# Altium schematic sheet quadrotor_100N_Sheet1.SchDoc
size A2
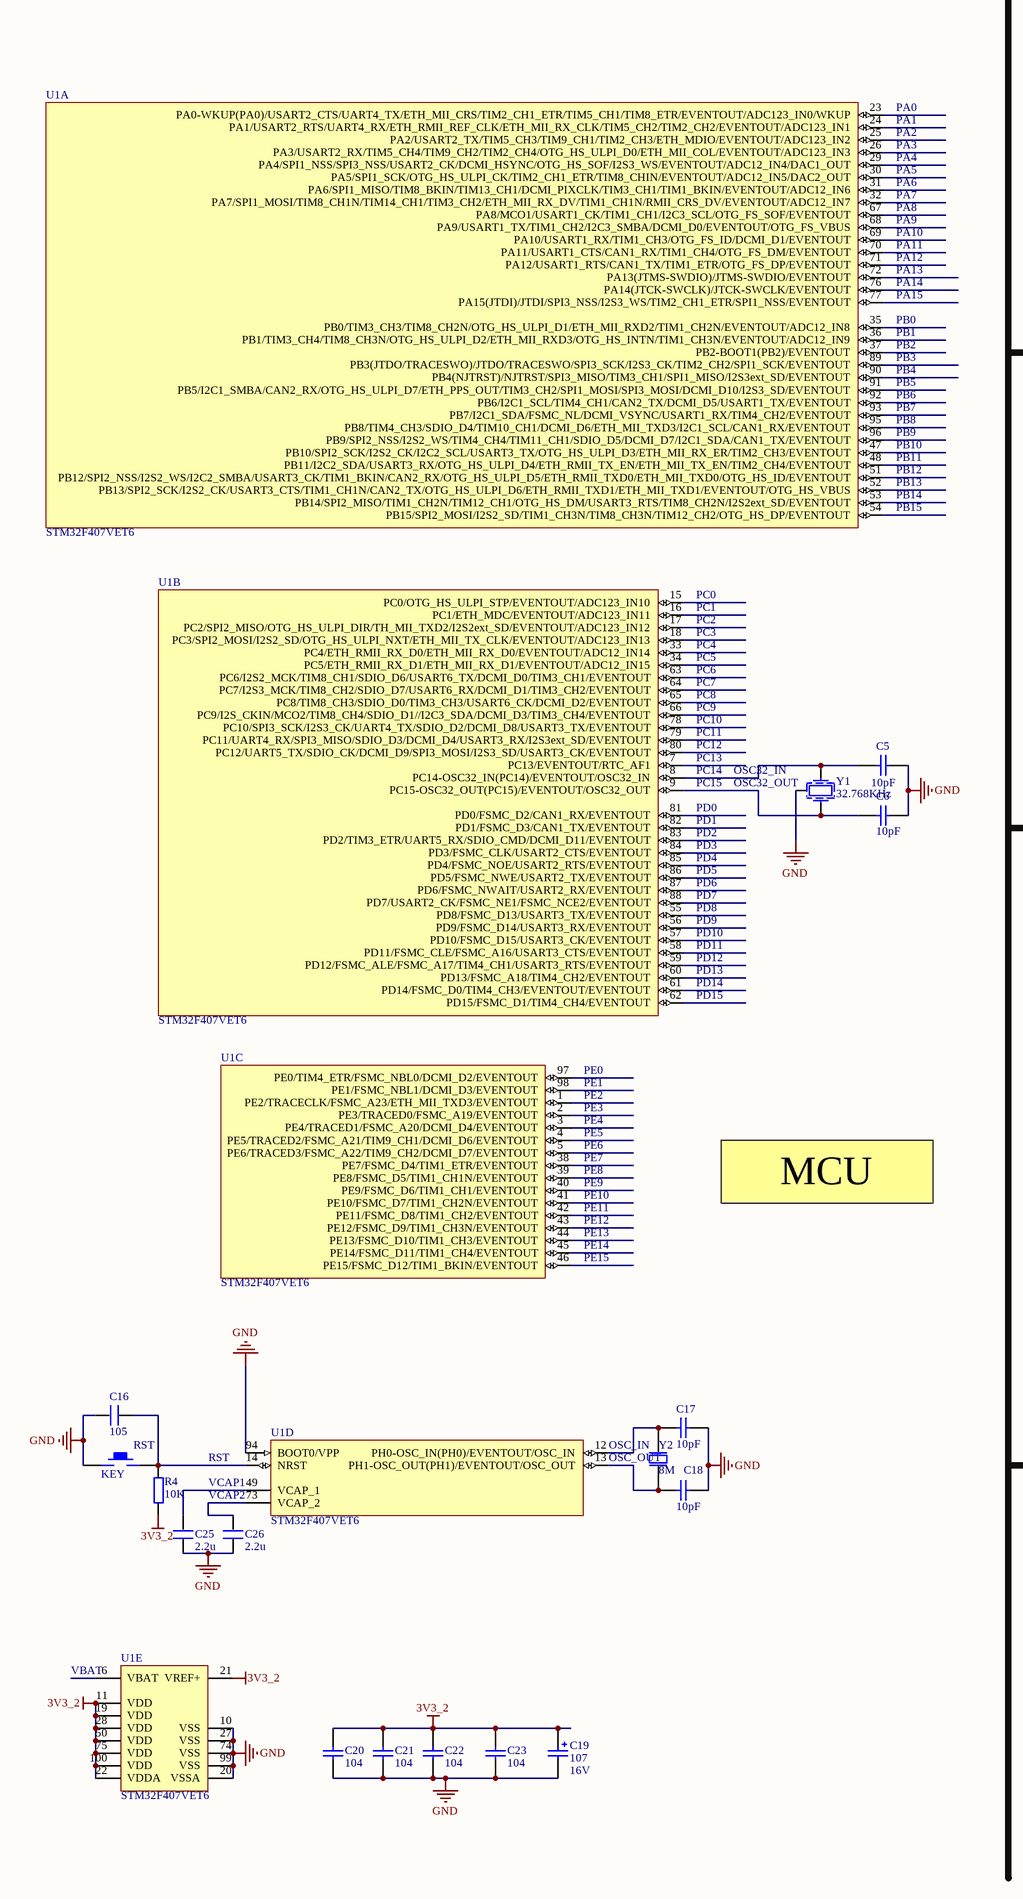
[diagram p0: quadrotor_100N_Sheet1.SchDoc, left]
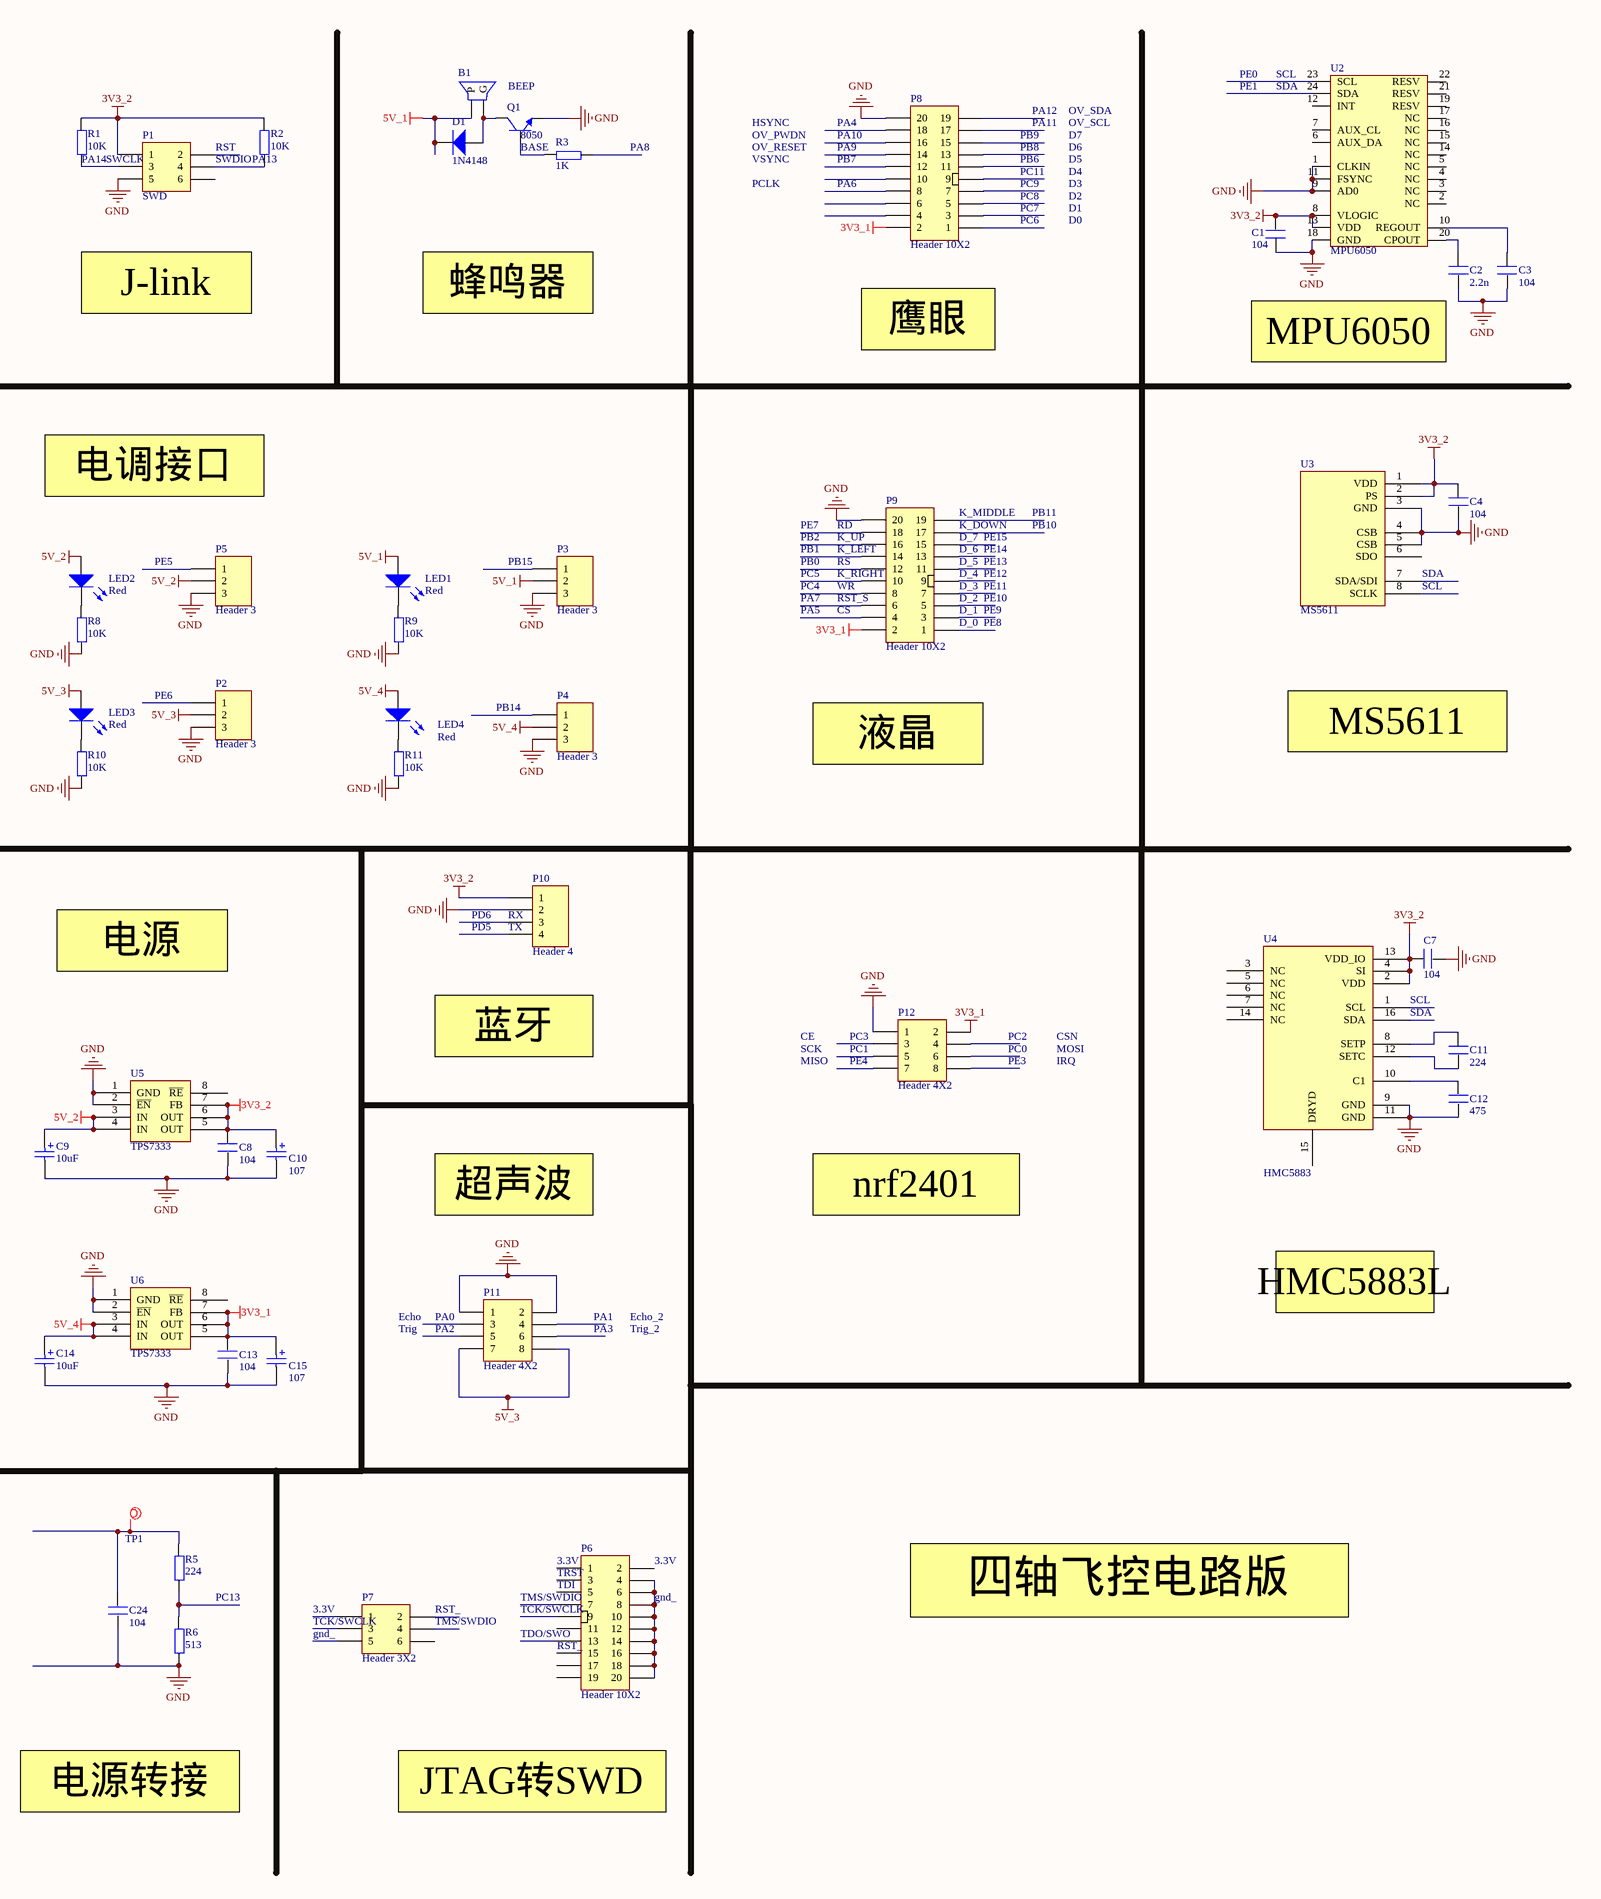
[diagram p1: quadrotor_100N_Sheet1.SchDoc, right]

## Parts
B1  BEEP  [BEEP]
C1  104  [C0805]
C2  2.2n  [C0805]
C3  104  [C0805]
C4  104  [C0805]
C5  10pF  [CAPC2012[0805]]
C6  10pF  [CAPC2012[0805]]
C7  104  [C0805]
C8  104  [C0805]
C9  10uF  [CAPS8]
C10  107  [CAPT6032]
C11  224  [C0805]
C12  475  [C0805]
C13  104  [C0805]
C14  10uF  [CAPS8]
C15  107  [CAPT6032]
C16  105  [C0805]
C17  10pF  [CAPC2012[0805]]
C18  10pF  [CAPC2012[0805]]
C19  Voltage: 16V  [CAPT6032]  (hidden comment: 107)
C20  104  [CAPC2012[0805]]
C21  104  [CAPC2012[0805]]
C22  104  [CAPC2012[0805]]
C23  104  [CAPC2012[0805]]
C24  104  [0805C]
C25  2.2u  [C0805]
C26  2.2u  [C0805]
D1  1N4148  [SOD-80[LL-34]]
LED1  Red  [LEDC2012(0805)]
LED2  Red  [LEDC2012(0805)]
LED3  Red  [LEDC2012(0805)]
LED4  Red  [LEDC2012(0805)]
P1  SWD  [HDR2X3]
P2  Header 3  [HDR1X3]
P3  Header 3  [HDR1X3]
P4  Header 3  [HDR1X3]
P5  Header 3  [HDR1X3]
P6  Header 10X2  [IDC2.54-20]
P7  Header 3X2  [HDR2X3]
P8  Header 10X2  [HDR2X10]
P9  Header 10X2  [HDR2X10]
P10  Header 4  [HX2.54V-4]
P11  Header 4X2  [HDR2X4]
P12  Header 4X2  [HDR2X4]
Q1  8050  [SOT23]
R1  10K  [0805]
R2  10K  [0805]
R3  1K  [0805]
R4  10K  [0805]
R5  224  [0805R]
R6  513  [0805R]
R8  10K  [0805]
R9  10K  [0805]
R10  10K  [0805]
R11  10K  [0805]
RST  KEY  [KEY]
TP1  Test Point  [TESTPOINT_PAD_3]  (value not drawn)  (no BOM)
U1  STM32F407VET6  [LQFP100_M]  (parts A,B,C,D,E of 5)
U2  MPU6050  [QFN24]
U3  MS5611  [MS5611]
U4  HMC5883  [QFN16]
U5  TPS7333  [TPS7333]
U6  TPS7333  [TPS7333]
Y1  32.768KHz  [XTAL]
Y2  8M  [XTAL-SMD]

## Nets
3V3_1: C13.2 C15.1 P8.2 P9.2 P12.2 U6.5(OUT) U6.6(OUT) U6.7(FB)
3V3_2: C1.1 C4.2 C7.1 C8.2 C10.1 C19.1 C20.2 C21.2 C22.2 C23.2 P1.1 P10.1 R1.2 R2.2 R4.1 U1.11(VDD) U1.19(VDD) U1.21(VREF+) U1.22(VDDA) U1.28(VDD) U1.50(VDD) U1.75(VDD) U1.100(VDD) U2.8(VLOGIC) U2.13(VDD) U3.1(VDD) U3.2(PS) U4.2(VDD) U4.4(SI) U4.13(VDD_IO) U5.5(OUT) U5.6(OUT) U5.7(FB)
5V_1: B1.1(P) D1.K LED1.A P3.2
5V_2: C9.1 LED2.A P5.2 U5.3(IN) U5.4(IN)
5V_3: LED3.A P2.2 P11.7 P11.8
5V_4: C14.1 LED4.A P4.2 U6.3(IN) U6.4(IN)
GND: C1.2 C2.1 C3.1 C4.1 C5.2 C6.2 C7.2 C8.1 C9.2 C10.2 C12.1 C13.1 C14.2 C15.2 C16.1 C17.2 C18.2 C19.2 C20.1 C21.1 C22.1 C23.1 C24.1 C25.1 C26.1 P1.5 P2.3 P3.3 P4.3 P5.3 P8.20 P9.20 P10.2 P11.1 P11.2 P12.1 Q1.2(E) R6.1 R8.1 R9.1 R10.1 R11.1 RST.1 U1.10(VSS) U1.20(VSSA) U1.27(VSS) U1.74(VSS) U1.94(BOOT0/VPP) U1.99(VSS) U2.1(CLKIN) U2.9(AD0) U2.11(FSYNC) U2.18(GND) U3.3(GND) U3.4(CSB) U3.5(CSB) U4.9(GND) U4.11(GND) U5.1(GND) U5.2(~{EN}) U6.1(GND) U6.2(~{EN}) Y1.3
3.3V: P6.1 P6.2 P7.1
BASE: Q1.1(B) R3.1
CS: P9.4 U1.30(PA5/SPI1_SCK/OTG_HS_ULPI_CK/TIM2_CH1_ETR/TIM8_CHIN/EVENTOUT/ADC12_IN5/DAC2_OUT)  [also labelled PA5]
D_0: P9.1 U1.39(PE8/FSMC_D5/TIM1_CH1N/EVENTOUT)  [also labelled PE8]
D_1: P9.3 U1.40(PE9/FSMC_D6/TIM1_CH1/EVENTOUT)  [also labelled PE9]
D_2: P9.5 U1.41(PE10/FSMC_D7/TIM1_CH2N/EVENTOUT)  [also labelled PE10]
D_3: P9.7 U1.42(PE11/FSMC_D8/TIM1_CH2/EVENTOUT)  [also labelled PE11]
D_4: P9.9 U1.43(PE12/FSMC_D9/TIM1_CH3N/EVENTOUT)  [also labelled PE12]
D_5: P9.11 U1.44(PE13/FSMC_D10/TIM1_CH3/EVENTOUT)  [also labelled PE13]
D_6: P9.13 U1.45(PE14/FSMC_D11/TIM1_CH4/EVENTOUT)  [also labelled PE14]
D_7: P9.15 U1.46(PE15/FSMC_D12/TIM1_BKIN/EVENTOUT)  [also labelled PE15]
gnd_: P6.4 P6.6 P6.8 P6.10 P6.12 P6.14 P6.16 P6.18 P6.20 P7.5
K_DOWN: P9.17 U1.47(PB10/SPI2_SCK/I2S2_CK/I2C2_SCL/USART3_TX/OTG_HS_ULPI_D3/ETH_MII_RX_ER/TIM2_CH3/EVENTOUT)  [also labelled PB10]
K_LEFT: P9.14 U1.36(PB1/TIM3_CH4/TIM8_CH3N/OTG_HS_ULPI_D2/ETH_MII_RXD3/OTG_HS_INTN/TIM1_CH3N/EVENTOUT/ADC12_IN9)  [also labelled PB1]
K_MIDDLE: P9.19 U1.48(PB11/I2C2_SDA/USART3_RX/OTG_HS_ULPI_D4/ETH_RMII_TX_EN/ETH_MII_TX_EN/TIM2_CH4/EVENTOUT)  [also labelled PB11]
K_RIGHT: P9.10 U1.34(PC5/ETH_RMII_RX_D1/ETH_MII_RX_D1/EVENTOUT/ADC12_IN15)  [also labelled PC5]
K_UP: P9.16 U1.37(PB2-BOOT1(PB2)/EVENTOUT)  [also labelled PB2]
OSC32_IN: C5.1 U1.8(PC14-OSC32_IN(PC14)/EVENTOUT/OSC32_IN) Y1.1  [also labelled PC14]
OSC32_OUT: C6.1 U1.9(PC15-OSC32_OUT(PC15)/EVENTOUT/OSC32_OUT) Y1.2  [also labelled PC15]
OSC_IN: C17.1 U1.12(PH0-OSC_IN(PH0)/EVENTOUT/OSC_IN) Y2.2(OSC2)
OSC_OUT: C18.1 U1.13(PH1-OSC_OUT(PH1)/EVENTOUT/OSC_OUT) Y2.1(OSC1)
PA0: P11.3 U1.23(PA0-WKUP(PA0)/USART2_CTS/UART4_TX/ETH_MII_CRS/TIM2_CH1_ETR/TIM5_CH1/TIM8_ETR/EVENTOUT/ADC123_IN0/WKUP)
PA1: P11.4 U1.24(PA1/USART2_RTS/UART4_RX/ETH_RMII_REF_CLK/ETH_MII_RX_CLK/TIM5_CH2/TIM2_CH2/EVENTOUT/ADC123_IN1)
PA2: P11.5 U1.25(PA2/USART2_TX/TIM5_CH3/TIM9_CH1/TIM2_CH3/ETH_MDIO/EVENTOUT/ADC123_IN2)
PA3: P11.6 U1.26(PA3/USART2_RX/TIM5_CH4/TIM9_CH2/TIM2_CH4/OTG_HS_ULPI_D0/ETH_MII_COL/EVENTOUT/ADC123_IN3)
PA4: P8.18 U1.29(PA4/SPI1_NSS/SPI3_NSS/USART2_CK/DCMI_HSYNC/OTG_HS_SOF/I2S3_WS/EVENTOUT/ADC12_IN4/DAC1_OUT)
PA6: P8.8 U1.31(PA6/SPI1_MISO/TIM8_BKIN/TIM13_CH1/DCMI_PIXCLK/TIM3_CH1/TIM1_BKIN/EVENTOUT/ADC12_IN6)
PA7: P9.6 U1.32(PA7/SPI1_MOSI/TIM8_CH1N/TIM14_CH1/TIM3_CH2/ETH_MII_RX_DV/TIM1_CH1N/RMII_CRS_DV/EVENTOUT/ADC12_IN7)  [also labelled RST_S]
PA8: R3.2 U1.67(PA8/MCO1/USART1_CK/TIM1_CH1/I2C3_SCL/OTG_FS_SOF/EVENTOUT)
PA9: P8.14 U1.68(PA9/USART1_TX/TIM1_CH2/I2C3_SMBA/DCMI_D0/EVENTOUT/OTG_FS_VBUS)
PA10: P8.16 U1.69(PA10/USART1_RX/TIM1_CH3/OTG_FS_ID/DCMI_D1/EVENTOUT)
PA11: P8.17 U1.70(PA11/USART1_CTS/CAN1_RX/TIM1_CH4/OTG_FS_DM/EVENTOUT)
PA12: P8.19 U1.71(PA12/USART1_RTS/CAN1_TX/TIM1_ETR/OTG_FS_DP/EVENTOUT)
PA13: P1.4 R2.1 U1.72(PA13(JTMS-SWDIO)/JTMS-SWDIO/EVENTOUT)  [also labelled SWDIO]
PA14: P1.3 R1.1 U1.76(PA14(JTCK-SWCLK)/JTCK-SWCLK/EVENTOUT)  [also labelled SWCLK]
PA15: U1.77(PA15(JTDI)/JTDI/SPI3_NSS/I2S3_WS/TIM2_CH1_ETR/SPI1_NSS/EVENTOUT)
PB0: P9.12 U1.35(PB0/TIM3_CH3/TIM8_CH2N/OTG_HS_ULPI_D1/ETH_MII_RXD2/TIM1_CH2N/EVENTOUT/ADC12_IN8)  [also labelled RS]
PB3: U1.89(PB3(JTDO/TRACESWO)/JTDO/TRACESWO/SPI3_SCK/I2S3_CK/TIM2_CH2/SPI1_SCK/EVENTOUT)
PB4: U1.90(PB4(NJTRST)/NJTRST/SPI3_MISO/TIM3_CH1/SPI1_MISO/I2S3ext_SD/EVENTOUT)
PB5: U1.91(PB5/I2C1_SMBA/CAN2_RX/OTG_HS_ULPI_D7/ETH_PPS_OUT/TIM3_CH2/SPI1_MOSI/SPI3_MOSI/DCMI_D10/I2S3_SD/EVENTOUT)
PB6: P8.11 U1.92(PB6/I2C1_SCL/TIM4_CH1/CAN2_TX/DCMI_D5/USART1_TX/EVENTOUT)
PB7: P8.12 U1.93(PB7/I2C1_SDA/FSMC_NL/DCMI_VSYNC/USART1_RX/TIM4_CH2/EVENTOUT)
PB8: P8.13 U1.95(PB8/TIM4_CH3/SDIO_D4/TIM10_CH1/DCMI_D6/ETH_MII_TXD3/I2C1_SCL/CAN1_RX/EVENTOUT)
PB9: P8.15 U1.96(PB9/SPI2_NSS/I2S2_WS/TIM4_CH4/TIM11_CH1/SDIO_D5/DCMI_D7/I2C1_SDA/CAN1_TX/EVENTOUT)
PB12: U1.51(PB12/SPI2_NSS/I2S2_WS/I2C2_SMBA/USART3_CK/TIM1_BKIN/CAN2_RX/OTG_HS_ULPI_D5/ETH_RMII_TXD0/ETH_MII_TXD0/OTG_HS_ID/EVENTOUT)
PB13: U1.52(PB13/SPI2_SCK/I2S2_CK/USART3_CTS/TIM1_CH1N/CAN2_TX/OTG_HS_ULPI_D6/ETH_RMII_TXD1/ETH_MII_TXD1/EVENTOUT/OTG_HS_VBUS)
PB14: P4.1 U1.53(PB14/SPI2_MISO/TIM1_CH2N/TIM12_CH1/OTG_HS_DM/USART3_RTS/TIM8_CH2N/I2S2ext_SD/EVENTOUT)
PB15: P3.1 U1.54(PB15/SPI2_MOSI/I2S2_SD/TIM1_CH3N/TIM8_CH3N/TIM12_CH2/OTG_HS_DP/EVENTOUT)
PC0: P12.6 U1.15(PC0/OTG_HS_ULPI_STP/EVENTOUT/ADC123_IN10)
PC1: P12.5 U1.16(PC1/ETH_MDC/EVENTOUT/ADC123_IN11)
PC2: P12.4 U1.17(PC2/SPI2_MISO/OTG_HS_ULPI_DIR/TH_MII_TXD2/I2S2ext_SD/EVENTOUT/ADC123_IN12)
PC3: P12.3 U1.18(PC3/SPI2_MOSI/I2S2_SD/OTG_HS_ULPI_NXT/ETH_MII_TX_CLK/EVENTOUT/ADC123_IN13)
PC4: P9.8 U1.33(PC4/ETH_RMII_RX_D0/ETH_MII_RX_D0/EVENTOUT/ADC12_IN14)  [also labelled WR]
PC6: P8.1 U1.63(PC6/I2S2_MCK/TIM8_CH1/SDIO_D6/USART6_TX/DCMI_D0/TIM3_CH1/EVENTOUT)
PC7: P8.3 U1.64(PC7/I2S3_MCK/TIM8_CH2/SDIO_D7/USART6_RX/DCMI_D1/TIM3_CH2/EVENTOUT)
PC8: P8.5 U1.65(PC8/TIM8_CH3/SDIO_D0/TIM3_CH3/USART6_CK/DCMI_D2/EVENTOUT)
PC9: P8.7 U1.66(PC9/I2S_CKIN/MCO2/TIM8_CH4/SDIO_D1//I2C3_SDA/DCMI_D3/TIM3_CH4/EVENTOUT)
PC10: U1.78(PC10/SPI3_SCK/I2S3_CK/UART4_TX/SDIO_D2/DCMI_D8/USART3_TX/EVENTOUT)
PC11: P8.9 U1.79(PC11/UART4_RX/SPI3_MISO/SDIO_D3/DCMI_D4/USART3_RX/I2S3ext_SD/EVENTOUT)
PC12: U1.80(PC12/UART5_TX/SDIO_CK/DCMI_D9/SPI3_MOSI/I2S3_SD/USART3_CK/EVENTOUT)
PC13: R5.1 R6.2 U1.7(PC13/EVENTOUT/RTC_AF1)
PD0: U1.81(PD0/FSMC_D2/CAN1_RX/EVENTOUT)
PD1: U1.82(PD1/FSMC_D3/CAN1_TX/EVENTOUT)
PD2: U1.83(PD2/TIM3_ETR/UART5_RX/SDIO_CMD/DCMI_D11/EVENTOUT)
PD3: U1.84(PD3/FSMC_CLK/USART2_CTS/EVENTOUT)
PD4: U1.85(PD4/FSMC_NOE/USART2_RTS/EVENTOUT)
PD5: P10.4 U1.86(PD5/FSMC_NWE/USART2_TX/EVENTOUT)  [also labelled TX]
PD6: P10.3 U1.87(PD6/FSMC_NWAIT/USART2_RX/EVENTOUT)  [also labelled RX]
PD7: U1.88(PD7/USART2_CK/FSMC_NE1/FSMC_NCE2/EVENTOUT)
PD8: U1.55(PD8/FSMC_D13/USART3_TX/EVENTOUT)
PD9: U1.56(PD9/FSMC_D14/USART3_RX/EVENTOUT)
PD10: U1.57(PD10/FSMC_D15/USART3_CK/EVENTOUT)
PD11: U1.58(PD11/FSMC_CLE/FSMC_A16/USART3_CTS/EVENTOUT)
PD12: U1.59(PD12/FSMC_ALE/FSMC_A17/TIM4_CH1/USART3_RTS/EVENTOUT)
PD13: U1.60(PD13/FSMC_A18/TIM4_CH2/EVENTOUT)
PD14: U1.61(PD14/FSMC_D0/TIM4_CH3/EVENTOUT/EVENTOUT)
PD15: U1.62(PD15/FSMC_D1/TIM4_CH4/EVENTOUT)
PE0: U1.97(PE0/TIM4_ETR/FSMC_NBL0/DCMI_D2/EVENTOUT) U2.23(SCL) U3.8(SCLK) U4.1(SCL)  [also labelled SCL]
PE1: U1.98(PE1/FSMC_NBL1/DCMI_D3/EVENTOUT) U2.24(SDA) U3.7(SDA/SDI) U4.16(SDA)  [also labelled SDA]
PE2: U1.1(PE2/TRACECLK/FSMC_A23/ETH_MII_TXD3/EVENTOUT)
PE3: P12.8 U1.2(PE3/TRACED0/FSMC_A19/EVENTOUT)
PE4: P12.7 U1.3(PE4/TRACED1/FSMC_A20/DCMI_D4/EVENTOUT)
PE5: P5.1 U1.4(PE5/TRACED2/FSMC_A21/TIM9_CH1/DCMI_D6/EVENTOUT)
PE6: P2.1 U1.5(PE6/TRACED3/FSMC_A22/TIM9_CH2/DCMI_D7/EVENTOUT)
PE7: P9.18 U1.38(PE7/FSMC_D4/TIM1_ETR/EVENTOUT)  [also labelled RD]
RST: C16.2 P1.2 R4.2 RST.2 U1.14(NRST)
RST_: P6.15 P7.2
TCK/SWCLK: P6.9 P7.3
TDI: P6.5
TDO/SWO: P6.13
TMS/SWDIO: P6.7 P7.4
TRST: P6.3
VBAT: U1.6(VBAT)
VCAP1: C25.2 U1.49(VCAP_1)
VCAP2: C26.2 U1.73(VCAP_2)
NetB1_2: B1.2(G) D1.A Q1.3(C)
NetC2_2: C2.2 U2.20(CPOUT)
NetC3_2: C3.2 U2.10(REGOUT)
NetC11_1: C11.1 U4.12(SETC)
NetC11_2: C11.2 U4.8(SETP)
NetC12_2: C12.2 U4.10(C1)
NetC24_2: C24.2 R5.2 TP1.1(TP)
NetLED1_C: LED1.C R9.2
NetLED2_C: LED2.C R8.2
NetLED3_C: LED3.C R10.2
NetLED4_C: LED4.C R11.2

Not connected (* = marked no-connect by the designer): P1 6; P6 11 17 19; P7 6; P8 4 6 10; U2 2(NC) 3(NC) 4(NC) 5(NC) 6(AUX_DA) 7(AUX_CL) 12(INT) 14(NC) 15(NC) 16(NC) 17(NC) 19(RESV) 21(RESV) 22(RESV); U3 6(SDO); U4 3(NC) 5(NC) 6(NC) 7(NC) 14(NC) 15(DRYD); U5 8(~{RE}); U6 8(~{RE})

## Notes on the sheet
- J-link
- 蜂鸣器
- 鹰眼
- (near C2) MPU6050
- 电调接口
- 液晶
- MS5611
- 电源
- 蓝牙
- MCU
- 超声波
- nrf2401
- HMC5883L
- 四轴飞控电路版
- 电源转接
- JTAG转SWD
- Labels drawn without touching a wire or pin: CE, CSN, D0, D1, D2, D3, D4, D5, D6, D7, Echo, Echo_2, HSYNC, IRQ, MISO, MOSI, OV_PWDN, OV_RESET, OV_SCL, OV_SDA, PCLK, SCK, Trig, Trig_2, VSYNC

## Library data of the parts
C1-C4 C7 C8 C11-C13 C16 C24-C26 = C
C5 C6 C17 C18 C20-C23 = Cap Chip 1: Chip Capacitor, PSpice Model; Tolerance: Y5V; Voltage: 63V; Published: 8-Jun-2000; Revision: July-2002: Re-released for DXP Platform.; Publisher: Altium Limited; Price(RMB): 0.000
  C5 C6 C17 C18: Value: 10pF
  C20-C23: Value: 104
C9 C14 = Cap Solid: Polarized Capacitor (Radial); Voltage: 16V; Published: 8-Jun-2000; Revision: July-2002: Re-released for DXP Platform.; Publisher: Altium Limited; Price(RMB): 0.000; Value: 10uF
C10 C15 = Cap Tan: Molded (Tantalum) Capacitor, 2-Leads,; Voltage: 16V; Published: 8-Jun-2000; Revision: July-2002: Re-released for DXP Platform.; Publisher: Altium Limited; Price(RMB): 0.000; Value: 107
C19 = Cap Tan: Molded (Tantalum) Capacitor, 2-Leads,; Published: 8-Jun-2000; Revision: July-2002: Re-released for DXP Platform.; Publisher: Altium Limited; Price(RMB): 0.000; Value: 107
D1 = Diode 1N4148: SMT Glass Diode, PSpice Model; Imax: 500mA; Published: 8-Jun-2000; Publisher: Altium Limited; Price(RMB): 0.000; PartNumber: 1N4148
LED1-LED4 = LED Chip: Typical Chip LED; Published: 8-Jun-2000; Revision: July-2002: Re-released for DXP Platform.; Publisher: Altium Limited; Price(RMB): 0.00; Color: Red
P1 P7 = Header 3X2: Header, 3-Pin, Dual row; LatestRevisionDate: 17-Jul-2002; LatestRevisionNote: Re-released for DXP Platform.; Publisher: Altium Limited; Price(RMB): 0.00
P2-P5 = Header 3: Header, 3-Pin; LatestRevisionDate: 17-Jul-2002; LatestRevisionNote: Re-released for DXP Platform.; Publisher: Altium Limited; Price(RMB): 0.00
P6 P8 P9 = Header 10X2: Header, 10-Pin, Dual row; LatestRevisionDate: 17-Jul-2002; LatestRevisionNote: Re-released for DXP Platform.; Publisher: Altium Limited; Price(RMB): 0.00
P10 = Header 4: Header, 4-Pin; LatestRevisionDate: 17-Jul-2002; LatestRevisionNote: Re-released for DXP Platform.; Publisher: Altium Limited; Price(RMB): 0.00
P11 P12 = Header 4X2: Header, 4-Pin, Dual row; LatestRevisionDate: 17-Jul-2002; LatestRevisionNote: Re-released for DXP Platform.; Publisher: Altium Limited; Price(RMB): 0.00
Q1 = NPN BC817-40: NPN Bipolar Transistor; Published: 8-Jun-2000; Revision: July-2002: Re-released for DXP Platform.; Publisher: Altium Limited; Price(RMB): 0.000; PartNumber: 8050
R1-R6 R8-R11 = R
TP1 = Test Point: Test Point for Manufature; Price(RMB): 0.000
U1 = STM32F407VET6: ARM Cortex-M4 32b MCU+FPU, 210DMIP, 512 kB Flash, 192+4 kB RAM, Camera, 82 I/Os, 100-pin LQFP, -40 to +85癈, Tray; Internal RAM: 192kB; Operating Frequency (Processor Speed): 168MHz; A/D Converter: 16x12-bit; D/A Converter: 2x12-bit; 16-bit Timers (IC/OC/PWM): 12x16-bit(24/24/30); 32-bit Timer (IC/OC/PWM): 2x32-bit (8/8/8); Other Timer Functions: 2xWDG, RTC, 24-bit down counter; Serial Interface: 3xSPI/2xI2S/2xI2C/3xUSART(IrDa, ISO7816)/3xUART/2xUSB OTG FS/HS, 2xCAN/Ethernet MAC10/100, SDIO; DatasheetVersion: rev2, Jan-2012; PackageVersion: 2012; PackageReference: LQFP100; PackageDescription: 100-Pin Low Profile Quad Flat Package, 14x14 mm Body, 0.5 mm Pitch; ComponentLink1Description: Manufacturer URL; ComponentLink1URL: http://www.st.com/; ComponentLink2Description: STM32F405/7 Datasheet; ComponentLink2URL: http://www.st.com/internet/com/TECHNICAL_RESOURCES/TECHNICAL_LITERATURE/DATASHEET/DM00037051.pdf; ComponentLink3Description: STM32F4 Web Page; ComponentLink3URL: http://www.st.com/internet/mcu/subclass/1521.jsp
U2 = MPU6050: 9轴运动处理传感器
Y1 = XTAL 3P: 3-pin Crystal Oscillator, Case Shelter; Price(RMB): 0.000; Value: 32.768KHz
Y2 = XTAL: Crystal Oscillator; Value: 16MHz; Published: 8-Jun-2000; Revision: July-2002: Re-released for DXP Platform.; Publisher: Altium Limited; Price(RMB): 0.000